# Altium schematic sheet Sh_ADC-DAC_Main.SchDoc
size A4
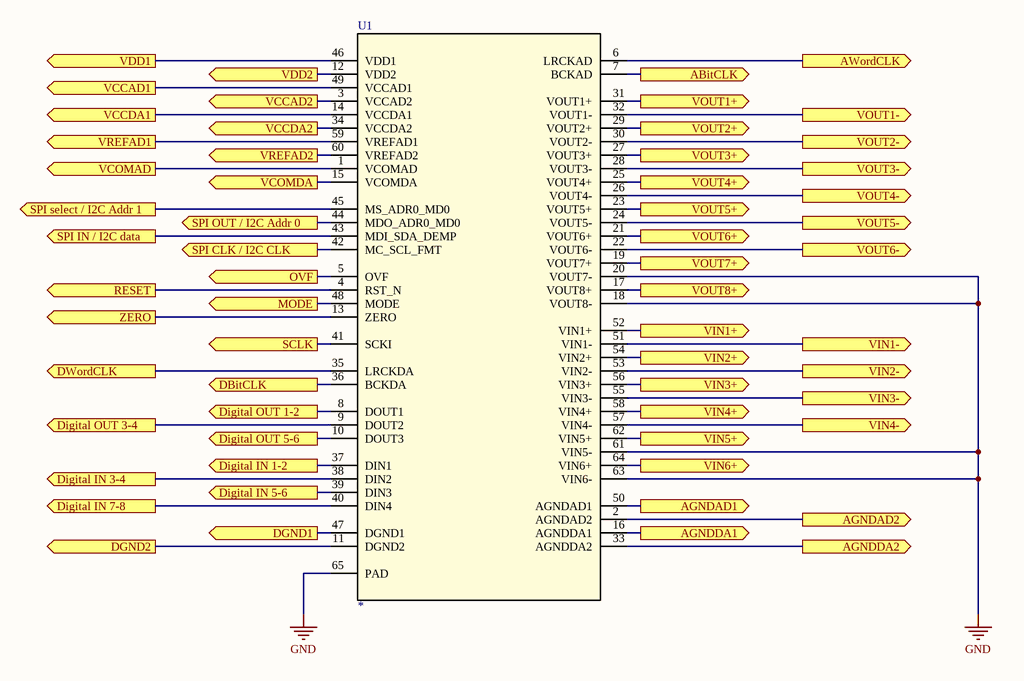
[diagram p0: Sh_ADC-DAC_Main.SchDoc]

## Parts
U1  *  [PAP0064J_N]

## Ports
ABitCLK (out), AGNDAD1 (out), AGNDAD2 (out), AGNDDA1 (out), AGNDDA2 (out), AWordCLK (out), DBitCLK (out), DGND1 (out), DGND2 (out), Digital IN 1-2 (out), Digital IN 3-4 (out), Digital IN 5-6 (out), Digital IN 7-8 (out), Digital OUT 1-2 (out), Digital OUT 3-4 (out), Digital OUT 5-6 (out), DWordCLK (out), MODE (out), OVF (out), RESET (out), SCLK (out), SPI CLK / I2C CLK (out), SPI IN / I2C data (out), SPI OUT / I2C Addr 0 (out), SPI select / I2C Addr 1 (out), VCCAD1 (out), VCCAD2 (out), VCCDA1 (out), VCCDA2 (out), VCOMAD (out), VCOMDA (out), VDD1 (out), VDD2 (out), VIN1+ (out), VIN1- (out), VIN2+ (out), VIN2- (out), VIN3+ (out), VIN3- (out), VIN4+ (out), VIN4- (out), VIN5+ (out), VIN6+ (out), VOUT1+ (out), VOUT1- (out), VOUT2+ (out), VOUT2- (out), VOUT3+ (out), VOUT3- (out), VOUT4+ (out), VOUT4- (out), VOUT5+ (out), VOUT5- (out), VOUT6+ (out), VOUT6- (out), VOUT7+ (out), VOUT8+ (out), VREFAD1 (out), VREFAD2 (out), ZERO (out)

## Nets
GND: U1.18(VOUT8-) U1.20(VOUT7-) U1.61(VIN5-) U1.63(VIN6-) U1.65(PAD)
ABitCLK: U1.7(BCKAD) ; port ABitCLK
AGNDAD1: U1.50(AGNDAD1) ; port AGNDAD1
AGNDAD2: U1.2(AGNDAD2) ; port AGNDAD2
AGNDDA1: U1.16(AGNDDA1) ; port AGNDDA1
AGNDDA2: U1.33(AGNDDA2) ; port AGNDDA2
AWordCLK: U1.6(LRCKAD) ; port AWordCLK
DBitCLK: U1.36(BCKDA) ; port DBitCLK
DGND1: U1.47(DGND1) ; port DGND1
DGND2: U1.11(DGND2) ; port DGND2
Digital IN 1-2: U1.37(DIN1) ; port Digital IN 1-2
Digital IN 3-4: U1.38(DIN2) ; port Digital IN 3-4
Digital IN 5-6: U1.39(DIN3) ; port Digital IN 5-6
Digital IN 7-8: U1.40(DIN4) ; port Digital IN 7-8
Digital OUT 1-2: U1.8(DOUT1) ; port Digital OUT 1-2
Digital OUT 3-4: U1.9(DOUT2) ; port Digital OUT 3-4
Digital OUT 5-6: U1.10(DOUT3) ; port Digital OUT 5-6
DWordCLK: U1.35(LRCKDA) ; port DWordCLK
MODE: U1.48(MODE) ; port MODE
OVF: U1.5(OVF) ; port OVF
RESET: U1.4(RST_N) ; port RESET
SCLK: U1.41(SCKI) ; port SCLK
SPI CLK / I2C CLK: U1.42(MC_SCL_FMT) ; port SPI CLK / I2C CLK
SPI IN / I2C data: U1.43(MDI_SDA_DEMP) ; port SPI IN / I2C data
SPI OUT / I2C Addr 0: U1.44(MDO_ADR0_MD0) ; port SPI OUT / I2C Addr 0
SPI select / I2C Addr 1: U1.45(MS_ADR0_MD0) ; port SPI select / I2C Addr 1
VCCAD1: U1.49(VCCAD1) ; port VCCAD1
VCCAD2: U1.3(VCCAD2) ; port VCCAD2
VCCDA1: U1.14(VCCDA1) ; port VCCDA1
VCCDA2: U1.34(VCCDA2) ; port VCCDA2
VCOMAD: U1.1(VCOMAD) ; port VCOMAD
VCOMDA: U1.15(VCOMDA) ; port VCOMDA
VDD1: U1.46(VDD1) ; port VDD1
VDD2: U1.12(VDD2) ; port VDD2
VIN1+: U1.52(VIN1+) ; port VIN1+
VIN1-: U1.51(VIN1-) ; port VIN1-
VIN2+: U1.54(VIN2+) ; port VIN2+
VIN2-: U1.53(VIN2-) ; port VIN2-
VIN3+: U1.56(VIN3+) ; port VIN3+
VIN3-: U1.55(VIN3-) ; port VIN3-
VIN4+: U1.58(VIN4+) ; port VIN4+
VIN4-: U1.57(VIN4-) ; port VIN4-
VIN5+: U1.62(VIN5+) ; port VIN5+
VIN6+: U1.64(VIN6+) ; port VIN6+
VOUT1+: U1.31(VOUT1+) ; port VOUT1+
VOUT1-: U1.32(VOUT1-) ; port VOUT1-
VOUT2+: U1.29(VOUT2+) ; port VOUT2+
VOUT2-: U1.30(VOUT2-) ; port VOUT2-
VOUT3+: U1.27(VOUT3+) ; port VOUT3+
VOUT3-: U1.28(VOUT3-) ; port VOUT3-
VOUT4+: U1.25(VOUT4+) ; port VOUT4+
VOUT4-: U1.26(VOUT4-) ; port VOUT4-
VOUT5+: U1.23(VOUT5+) ; port VOUT5+
VOUT5-: U1.24(VOUT5-) ; port VOUT5-
VOUT6+: U1.21(VOUT6+) ; port VOUT6+
VOUT6-: U1.22(VOUT6-) ; port VOUT6-
VOUT7+: U1.19(VOUT7+) ; port VOUT7+
VOUT8+: U1.17(VOUT8+) ; port VOUT8+
VREFAD1: U1.59(VREFAD1) ; port VREFAD1
VREFAD2: U1.60(VREFAD2) ; port VREFAD2
ZERO: U1.13(ZERO) ; port ZERO

## Library data of the parts
U1 = PCM3168APAPR: Imported; Manufacturer: Texas Instruments; PartNumber: PCM3168APAPR; RefDes: RefDes; TYPE: TYPE; Value: Value